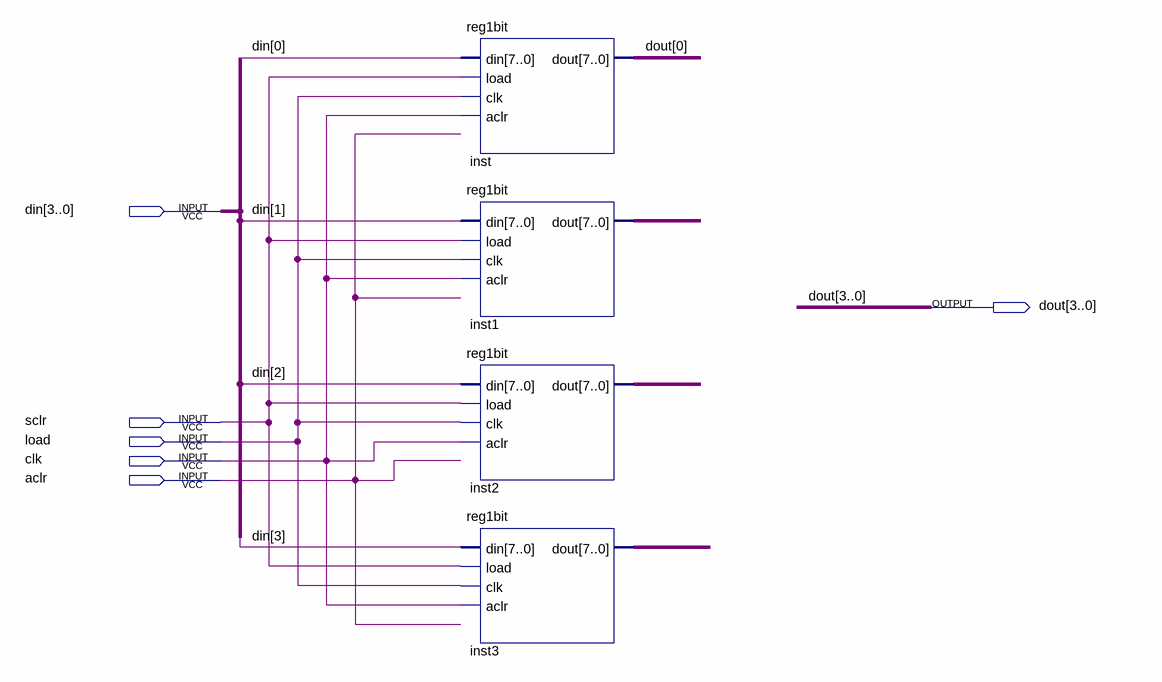
[diagram p0: schematic sheet]
// Quartus schematic reg4bit.bdf as structural Verilog: 4 symbols, 6 pins
module reg4bit (
  input  [3:0] din,
  input  sclr,
  input  load,
  input  clk,
  input  aclr,
  output [3:0] dout
);

  wire [7:0] inst1_dout, inst2_dout, inst3_dout;

  reg1bit inst (.din({8{din[0]}}), .load(sclr), .clk(load), .aclr(clk), .dout(dout[0]));
  reg1bit inst1 (.din({8{din[1]}}), .load(sclr), .clk(load), .aclr(clk), .dout(inst1_dout));
  reg1bit inst2 (.din({8{din[2]}}), .load(sclr), .clk(load), .aclr(clk), .dout(inst2_dout));
  reg1bit inst3 (.din({8{din[3]}}), .load(sclr), .clk(load), .aclr(clk), .dout(inst3_dout));
endmodule
